# EAGLE design line_sensor (EAGLE 9.6.0)
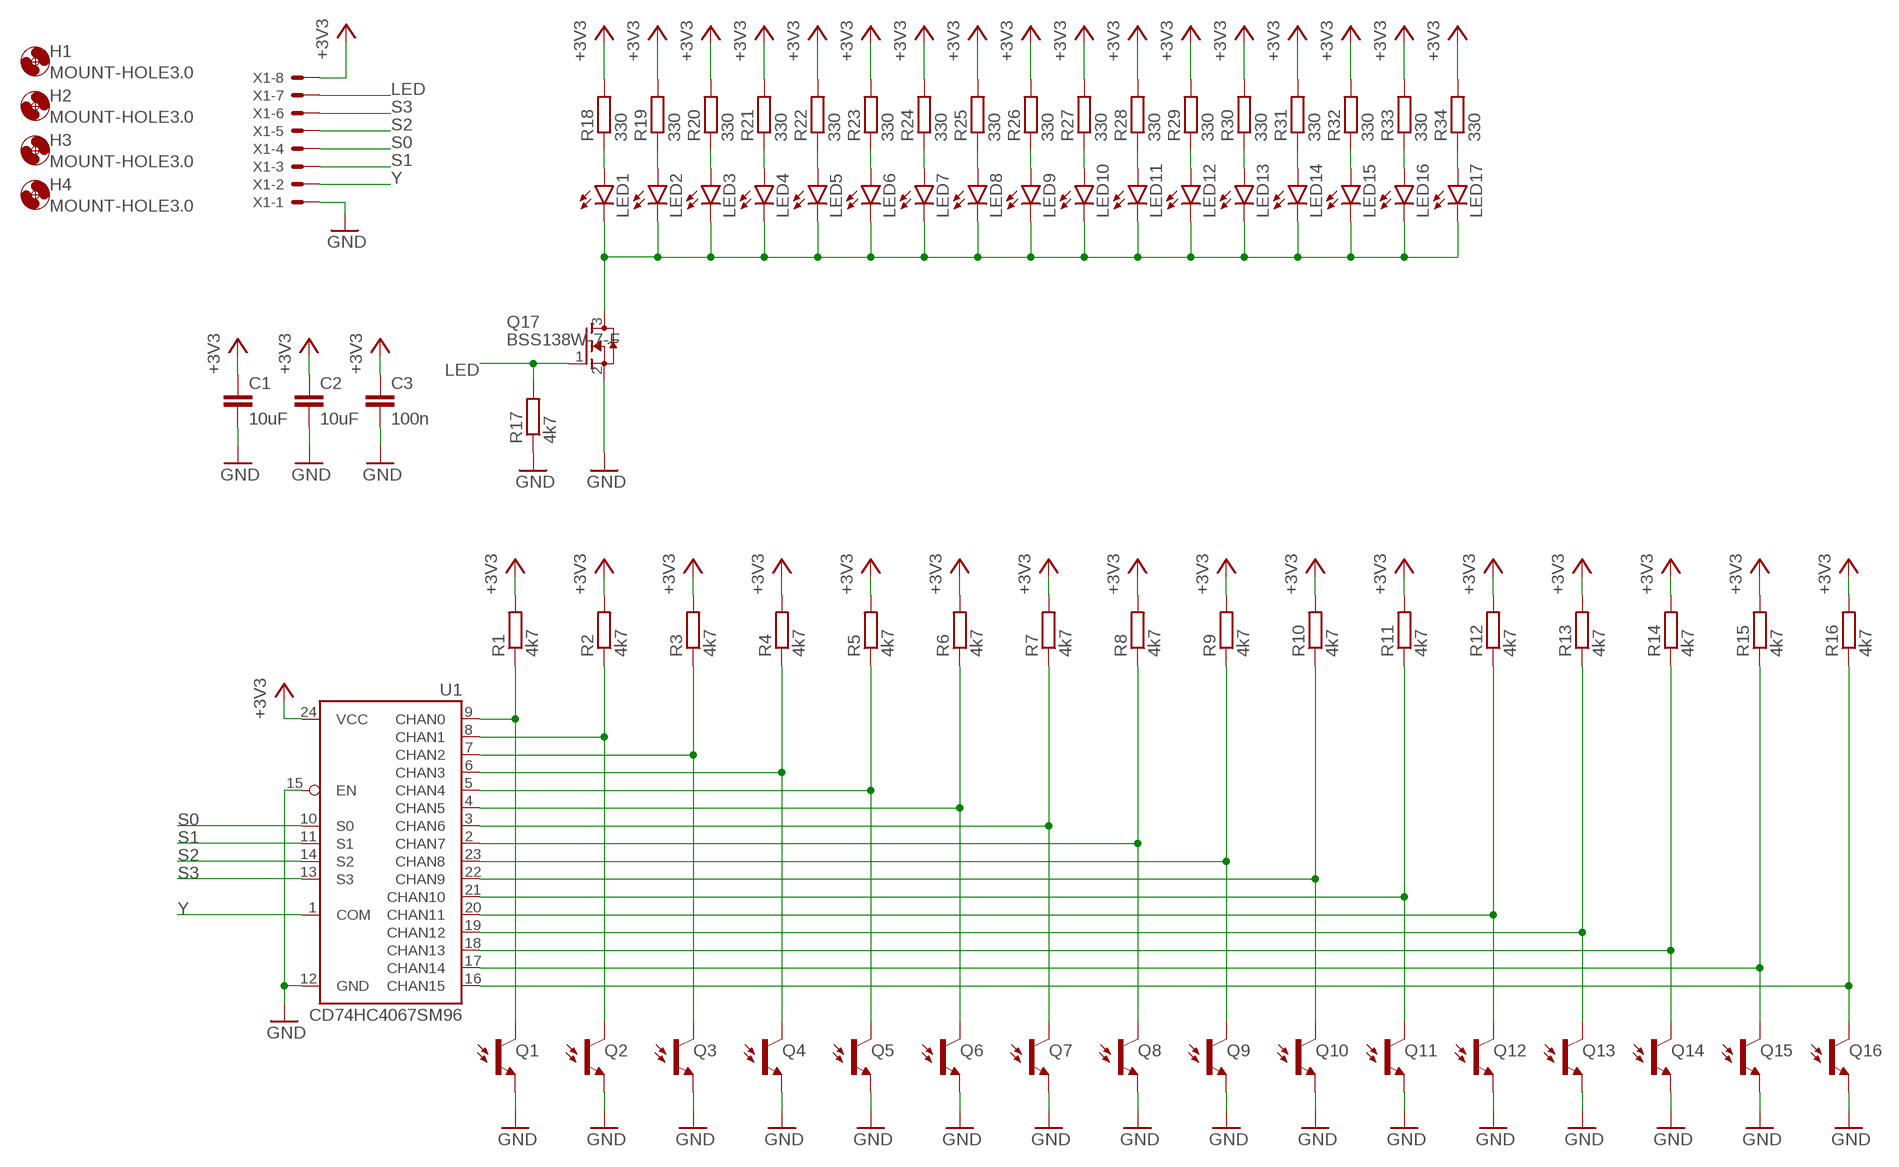
[diagram p0: schematic, sheet 1]

## Parts
C1  10uF  C-EUC0805  [C0805]
C2  10uF  C-EUC0805  [C0805]
C3  100n  C-EUC0805  [C0805]
H1  MOUNT-HOLE3.0  [3,0]
H2  MOUNT-HOLE3.0  [3,0]
H3  MOUNT-HOLE3.0  [3,0]
H4  MOUNT-HOLE3.0  [3,0]
LED1  LEDSML1206  [SML1206]
LED2  LEDSML1206  [SML1206]
LED3  LEDSML1206  [SML1206]
LED4  LEDSML1206  [SML1206]
LED5  LEDSML1206  [SML1206]
LED6  LEDSML1206  [SML1206]
LED7  LEDSML1206  [SML1206]
LED8  LEDSML1206  [SML1206]
LED9  LEDSML1206  [SML1206]
LED10  LEDSML1206  [SML1206]
LED11  LEDSML1206  [SML1206]
LED12  LEDSML1206  [SML1206]
LED13  LEDSML1206  [SML1206]
LED14  LEDSML1206  [SML1206]
LED15  LEDSML1206  [SML1206]
LED16  LEDSML1206  [SML1206]
LED17  LEDSML1206  [SML1206]
Q1  20mA/30V  PHOTOTRANSISTORPT17-21C-L41-TR8  [PT17-21C-L41-TR8]
Q2  20mA/30V  PHOTOTRANSISTORPT17-21C-L41-TR8  [PT17-21C-L41-TR8]
Q3  20mA/30V  PHOTOTRANSISTORPT17-21C-L41-TR8  [PT17-21C-L41-TR8]
Q4  20mA/30V  PHOTOTRANSISTORPT17-21C-L41-TR8  [PT17-21C-L41-TR8]
Q5  20mA/30V  PHOTOTRANSISTORPT17-21C-L41-TR8  [PT17-21C-L41-TR8]
Q6  20mA/30V  PHOTOTRANSISTORPT17-21C-L41-TR8  [PT17-21C-L41-TR8]
Q7  20mA/30V  PHOTOTRANSISTORPT17-21C-L41-TR8  [PT17-21C-L41-TR8]
Q8  20mA/30V  PHOTOTRANSISTORPT17-21C-L41-TR8  [PT17-21C-L41-TR8]
Q9  20mA/30V  PHOTOTRANSISTORPT17-21C-L41-TR8  [PT17-21C-L41-TR8]
Q10  20mA/30V  PHOTOTRANSISTORPT17-21C-L41-TR8  [PT17-21C-L41-TR8]
Q11  20mA/30V  PHOTOTRANSISTORPT17-21C-L41-TR8  [PT17-21C-L41-TR8]
Q12  20mA/30V  PHOTOTRANSISTORPT17-21C-L41-TR8  [PT17-21C-L41-TR8]
Q13  20mA/30V  PHOTOTRANSISTORPT17-21C-L41-TR8  [PT17-21C-L41-TR8]
Q14  20mA/30V  PHOTOTRANSISTORPT17-21C-L41-TR8  [PT17-21C-L41-TR8]
Q15  20mA/30V  PHOTOTRANSISTORPT17-21C-L41-TR8  [PT17-21C-L41-TR8]
Q16  20mA/30V  PHOTOTRANSISTORPT17-21C-L41-TR8  [PT17-21C-L41-TR8]
Q17  BSS138W-7-F  [SOT323]
R1  4k7  R-EU_M0805  [M0805]
R2  4k7  R-EU_M0805  [M0805]
R3  4k7  R-EU_M0805  [M0805]
R4  4k7  R-EU_M0805  [M0805]
R5  4k7  R-EU_M0805  [M0805]
R6  4k7  R-EU_M0805  [M0805]
R7  4k7  R-EU_M0805  [M0805]
R8  4k7  R-EU_M0805  [M0805]
R9  4k7  R-EU_M0805  [M0805]
R10  4k7  R-EU_M0805  [M0805]
R11  4k7  R-EU_M0805  [M0805]
R12  4k7  R-EU_M0805  [M0805]
R13  4k7  R-EU_M0805  [M0805]
R14  4k7  R-EU_M0805  [M0805]
R15  4k7  R-EU_M0805  [M0805]
R16  4k7  R-EU_M0805  [M0805]
R17  4k7  R-EU_M0805  [M0805]
R18  330  R-EU_M0805  [M0805]
R19  330  R-EU_M0805  [M0805]
R20  330  R-EU_M0805  [M0805]
R21  330  R-EU_M0805  [M0805]
R22  330  R-EU_M0805  [M0805]
R23  330  R-EU_M0805  [M0805]
R24  330  R-EU_M0805  [M0805]
R25  330  R-EU_M0805  [M0805]
R26  330  R-EU_M0805  [M0805]
R27  330  R-EU_M0805  [M0805]
R28  330  R-EU_M0805  [M0805]
R29  330  R-EU_M0805  [M0805]
R30  330  R-EU_M0805  [M0805]
R31  330  R-EU_M0805  [M0805]
R32  330  R-EU_M0805  [M0805]
R33  330  R-EU_M0805  [M0805]
R34  330  R-EU_M0805  [M0805]
U1  CD74HC4067SM96  74HC4067SM96  [SSOP24]
X1  52745-0890  [52745-0890]

## Nets
+3V3: C1.1 C2.1 C3.1 R1.2 R2.2 R3.2 R4.2 R5.2 R6.2 R7.2 R8.2 R9.2 R10.2 R11.2 R12.2 R13.2 R14.2 R15.2 R16.2 R18.2 R19.2 R20.2 R21.2 R22.2 R23.2 R24.2 R25.2 R26.2 R27.2 R28.2 R29.2 R30.2 R31.2 R32.2 R33.2 R34.2 U1.24(VCC) X1.8
GND: C1.2 C2.2 C3.2 Q1.E Q2.E Q3.E Q4.E Q5.E Q6.E Q7.E Q8.E Q9.E Q10.E Q11.E Q12.E Q13.E Q14.E Q15.E Q16.E Q17.2(S) R17.1 U1.12(GND) U1.15(EN) X1.1
LED: Q17.1(G) R17.2 X1.7
N$1: Q2.C R2.1 U1.8(CHAN1)
N$2: Q1.C R1.1 U1.9(CHAN0)
N$3: Q3.C R3.1 U1.7(CHAN2)
N$4: Q4.C R4.1 U1.6(CHAN3)
N$5: LED1.A R18.1
N$8: LED2.A R19.1
N$9: LED1.C LED2.C LED3.C LED4.C LED5.C LED6.C LED7.C LED8.C LED9.C LED10.C LED11.C LED12.C LED13.C LED14.C LED15.C LED16.C LED17.C Q17.3(D)
N$10: Q5.C R5.1 U1.5(CHAN4)
N$11: Q6.C R6.1 U1.4(CHAN5)
N$12: Q7.C R7.1 U1.3(CHAN6)
N$13: Q8.C R8.1 U1.2(CHAN7)
N$14: Q9.C R9.1 U1.23(CHAN8)
N$15: Q10.C R10.1 U1.22(CHAN9)
N$16: Q11.C R11.1 U1.21(CHAN10)
N$17: Q12.C R12.1 U1.20(CHAN11)
N$18: Q13.C R13.1 U1.19(CHAN12)
N$19: Q14.C R14.1 U1.18(CHAN13)
N$20: Q15.C R15.1 U1.17(CHAN14)
N$21: Q16.C R16.1 U1.16(CHAN15)
N$23: LED3.A R20.1
N$26: LED4.A R21.1
N$29: LED5.A R22.1
N$32: LED6.A R23.1
N$35: LED7.A R24.1
N$38: LED8.A R25.1
N$41: LED9.A R26.1
N$44: LED10.A R27.1
N$47: LED11.A R28.1
N$50: LED12.A R29.1
N$53: LED13.A R30.1
N$56: LED14.A R31.1
N$59: LED15.A R32.1
N$62: LED16.A R33.1
N$65: LED17.A R34.1
S0: U1.10(S0) X1.4
S1: U1.11(S1) X1.3
S2: U1.14(S2) X1.5
S3: U1.13(S3) X1.6
Y: U1.1(COM) X1.2

## Library data of the parts
C1-C3 = rcl:C-EU: CAPACITOR, European symbol; SPICEPREFIX: C
H1-H4 = holes:MOUNT-HOLE: MOUNTING HOLE with drill center marker
LED1-LED17 = led:LED: LED OSRAM: - CHIPLED LG R971, LG N971, LY N971, LG Q971, LY Q971, LO R971, LY R971 LH N974, LH R974 LS Q976, LO Q976, LY Q976 LO Q996 - Hyper CHIPLED LW Q18S LB Q993, LB Q99A, LB R99A - SideLED LS A670, LO A670, LY A670, LG A670, LP A670 LB A673, LV A673, LT A673, LW A673 LH A674 LY A675 LS A676, LA A676, LO A676, LY A676, LW A676 LS A679, LY A679, LG A679 - Hyper Micro SIDELED® LS Y876, LA Y876, LO Y876, LY Y876 LT Y87S - SmartLED LW L88C, LW L88S LB L89C, LB L89S, LG L890 LS L89K, LO L89K, LY L89K LS L896, LA L896, LO L896, LY L896 - TOPLED LS T670, LO T670, LY T670, LG T670, LP T670 LSG T670, LSP T670, LSY T670, LOP T670, LYG T670 LG T671, LOG T671, LSG T671 LB T673, LV T673, LT T673, LW T673 LH T674 LS T676, LA T676, LO T676, LY T676, LB T676, LH T676, LSB T676, LW T676 LB T67C, LV T67C, LT T67C, LS T67K, LO T67K, LY T67K, LW E67C LS E67B, LA E67B, LO E67B, LY E67B, LB E67C, LV E67C, LT E67C LW T67C LS T679, LY T679, LG T679 LS T770, LO T770, LY T770, LG T770, LP T770 LB T773, LV T773, LT T773, LW T773 LH T774 LS E675, LA E675, LY E675, LS T675 LS T776, LA T776, LO T776, LY T776, LB T776 LHGB T686 LT T68C, LB T68C - Hyper Mini TOPLED® LB M676 - Mini TOPLED Santana® LG M470 LS M47K, LO M47K, LY M47K Source: http://www.osram.convergy.de LUXEON: - LUMILED® LXK2-PW12-R00, LXK2-PW12-S00, LXK2-PW14-U00, LXK2-PW14-V00 LXK2-PM12-R00, LXK2-PM12-S00, LXK2-PM14-U00 LXK2-PE12-Q00, LXK2-PE12-R00, LXK2-PE12-S00, LXK2-PE14-T00, LXK2-PE14-U00 LXK2-PB12-K00, LXK2-PB12-L00, LXK2-PB12-M00, LXK2-PB14-N00, LXK2-PB14-P00, LXK2-PB14-Q00 LXK2-PR12-L00, LXK2-PR12-M00, LXK2-PR14-Q00, LXK2-PR14-R00 LXK2-PD12-Q00, LXK2-PD12-R00, LXK2-PD12-S00 LXK2-PH12-R00, LXK2-PH12-S00 LXK2-PL12-P00, LXK2-PL12-Q00, LXK2-PL12-R00 Source: www.luxeon.com KINGBRIGHT: KA-3528ASYC Source: www.kingbright.com
Q1-Q16 = SparkFun-DiscreteSemi:PHOTOTRANSISTOR: Phototransistor PT17-21C/L41/TR8 is a phototransistor in miniature SMD package which is molded in a water clear with flat top view lens. The device is Spectrally matched to visible and infrared emitting diode. Datasheet <http://www.everlight.com/file/ProductFile/PT17-21C-L41-TR8.pdf> SparkFun Products: SparkFun Electric Imp imp002 Breakout <https://www.sparkfun.com/products/12958>; PROD_ID: TRANS-12141
Q17 = borkedlabs-transistors:BSS138W-7-F: N-FET; MANU: DIODES INC; MPN: BSS138W-7-F; PACKAGE: SOT323
R1-R34 = rcl:R-EU_: RESISTOR, European symbol; SPICEPREFIX: R
U1 = SparkFun-IC-Logic:74*4067: 16-channel analog MUX Datasheet <http://www.sparkfun.com/datasheets/IC/cd74hc4067.pdf> SparkFun Products MP3 Trigger <https://www.sparkfun.com/products/13720> (WIG-13720) SparkFun Analog/Digital MUX Breakout - CD74HC4067 <https://www.sparkfun.com/products/9056> (BOB-09056); PROD_ID: IC-08252
X1 = con-molex:52745-0890: FFC/FPC-to-Board 0.50mm (.020") SMT Top Contact Right Angle, ZIF, Style Receptacle 52745 / 52435 Source: http://www.molex.com/product/ffc/52745.html; MF: MOLEX; MPN: 52745-0890; OC_FARNELL: unknown; OC_NEWARK: 92M6377

## Board
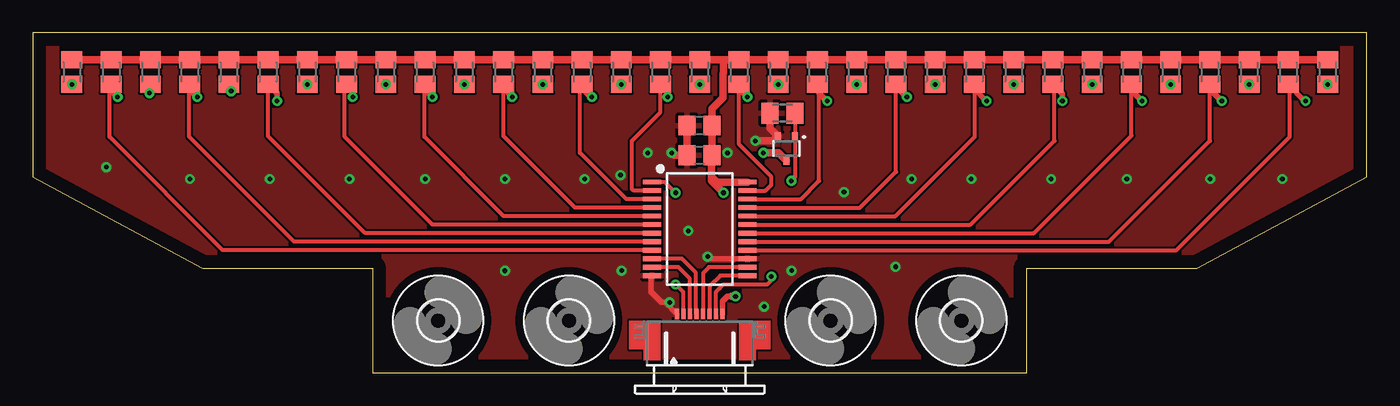
[diagram p1: board, top side]
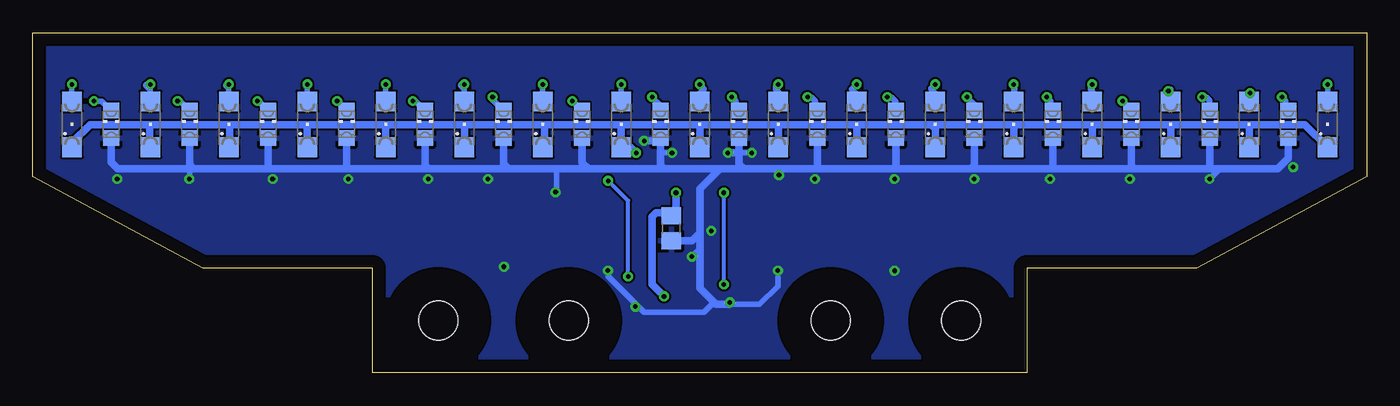
[diagram p2: board, bottom side, seen from below]

Size 102 x 26 mm. Coordinates in mm from the lower left corner, seen from the top.
Outline: 13,8 26,8 26,0 76,0 76,8 89,8 102,15 102,26 0,26 0,15 13,8
Copper layers (1*16): Top 0.035mm / dielectric 1.5mm / Bottom 0.035mm
Design rules "default": minimum track width 6mil, minimum drill 0.35mm, track to track 6mil, track to pad 6mil, pad to pad 6mil, via to via 6mil, smd to smd 6mil, copper to edge 40mil, drill to drill 6mil, minimum pad ring 10mil, minimum via ring 8mil, stop-mask expansion 4mil, vias tented up to drill 0mil, thermal gap 10mil

### Footprints (pad centres in the part's own frame; a part is rotated, then mirrored left to right if it is on the bottom)
C0805 = smd 1.3 x 1.5: 1 -0.95,0; 2 0.95,0
3,0 = hole 3: 0,0
SML1206 = smd 1.5 x 1.5: A 1.75,0; C -1.75,0
PT17-21C-L41-TR8 = smd 1.2 x 1.2: C 0,1.05; E 0,-1.05
SOT323 = smd 0.47 x 0.6: 1 -0.65,-0.95; 2 0.65,-0.95; 3 0,0.95
M0805 = smd 1.3 x 1.6: 1 -0.95,0; 2 0.95,0
SSOP24 = smd 0.348 x 1.397: 1 -3.575,-3.656; 2 -2.925,-3.656; 3 -2.275,-3.656; 4 -1.625,-3.656; 5 -0.975,-3.656; 6 -0.325,-3.656; 7 0.325,-3.656; 8 0.975,-3.656; 9 1.625,-3.656; 10 2.275,-3.656; 11 2.925,-3.656; 12 3.575,-3.656; 13 3.575,3.656; 14 2.925,3.656; 15 2.275,3.656; 16 1.625,3.656; 17 0.975,3.656; 18 0.325,3.656; 19 -0.325,3.656; 20 -0.975,3.656; 21 -1.625,3.656; 22 -2.275,3.656; 23 -2.925,3.656; 24 -3.575,3.656
52745-0890 = smd 0.3 x 0.8: 1 -1.75,2.5; 2 -1.25,2.5; 3 -0.75,2.5; 4 -0.25,2.5; 5 0.25,2.5; 6 0.75,2.5; 7 1.25,2.5; 8 1.75,2.5

### Placement (x,y rotation side)
C1  53.17,11.05 270 bottom
C2  50.97,18.9 180 top
C3  50.97,16.63 180 top
H1  61,4 0 top
H2  31,4 0 top
H3  71,4 0 top
H4  41,4 0 top
LED1  3,19 90 bottom
LED2  9,19 90 bottom
LED3  15,19 90 bottom
LED4  21,19 90 bottom
LED5  27,19 90 bottom
LED6  33,19 90 bottom
LED7  39,19 90 bottom
LED8  45,19 90 bottom
LED9  51,19 90 bottom
LED10  57,19 90 bottom
LED11  63,19 90 bottom
LED12  69,19 90 bottom
LED13  75,19 90 bottom
LED14  81,19 90 bottom
LED15  87,19 90 bottom
LED16  93,19 90 bottom
LED17  99,19 90 bottom
Q1  6,19 0 bottom
Q2  12,19 0 bottom
Q3  18,19 0 bottom
Q4  24,19 0 bottom
Q5  30,19 0 bottom
Q6  36,19 0 bottom
Q7  42,19 0 bottom
Q8  48,19 0 bottom
Q9  54,19 0 bottom
Q10  60,19 0 bottom
Q11  66,19 0 bottom
Q12  72,19 0 bottom
Q13  78,19 0 bottom
Q14  84,19 0 bottom
Q15  90,19 0 bottom
Q16  96,19 0 bottom
Q17  57.62,17.15 180 top
R1  6,23 90 top
R2  12,23 90 top
R3  18,23 90 top
R4  24,23 90 top
R5  30,23 90 top
R6  36,23 90 top
R7  42,23 90 top
R8  48,23 90 top
R9  54,23 90 top
R10  60,23 90 top
R11  66,23 90 top
R12  72,23 90 top
R13  78,23 90 top
R14  84,23 90 top
R15  90,23 90 top
R16  96,23 90 top
R17  57.32,19.84 0 top
R18  3,23 90 top
R19  9,23 90 top
R20  15,23 90 top
R21  21,23 90 top
R22  27,23 90 top
R23  33,23 90 top
R24  39,23 90 top
R25  45,23 90 top
R26  51,23 90 top
R27  57,23 90 top
R28  63,23 90 top
R29  69,23 90 top
R30  75,23 90 top
R31  81,23 90 top
R32  87,23 90 top
R33  93,23 90 top
R34  99,23 90 top
U1  51,11 270 top
X1  51,2 0 top

### Tracks (layer width: path | path; a pad name or v marks a point on that pad's centre or on a via)
+3V3  (via drill 0.35)
  Top 0.406: X1.8 52.75,5.47 53.12,5.84 53.43,5.84
  Top 0.559: R18.2 R1.2 R19.2 R2.2 R20.2 R3.2 R21.2 R4.2 R22.2 R5.2 R23.2 R6.2 R24.2 R7.2 R25.2 R8.2 R26.2 52.82,23.95 | 52.82,23.95 R9.2 R27.2 R10.2 R28.2 R11.2 R29.2 | R12.2 R29.2 | R29.2 R30.2 R13.2 R31.2 R14.2 R32.2 R15.2 R33.2 R16.2 R34.2 | 52.82,23.95 52.82,22.93 52.77,22.88 52.77,21.03 51.92,20.19 C2.1 51.92,17.12 | C3.1 51.92,17.12 | U1.24 52.31,14.58 51.9,14.99 | 51.9,14.99 51.9,17.1 51.92,17.12 | v52.82,13.77 51.9,14.68 51.9,14.99 | 53.43,5.84 v53.73,5.84
  Bottom 0.559: v52.82,13.77 52.82,12.36 C1.1 53.42,12.24 54.34,12.24 54.65,11.94 54.65,6.76 v53.73,5.84
GND  (via drill 0.35)
  Top 0.406: U1.15 51.76,8.73 v51.6,8.89 | U1.12 47.27,7.35 47.27,6.21 48.09,5.39 | 48.09,5.39 v48.7,5.39 | X1.1 48.36,5.39 48.09,5.39
  Top 0.559: C2.2 C3.2 49.04,16.63 v48.85,16.82 | R17.1 56.37,18.7 Q17.2 56.61,17.73 v55.25,17.73
  Bottom 0.406: v51.6,8.89 50.99,9.5 | 10.75,15.6 11.24,15.6 v12.03,14.82 | v47.02,16.82 48,16.82 | v53.12,16.82 54,16.82 | v62.02,13.82 61.96,13.88 61.96,15.6 | v90.03,14.82 90,14.84 90,15.6 | v58.02,7.82 58.02,7.39 55.25,4.62 50.68,4.62 49.92,5.39 | v45.02,7.82 45.02,6.62 46.41,5.23 49.16,5.23
  Bottom 0.559: Q1.E 6,16.39 6.79,15.6 10.75,15.6 11.97,15.6 | 11.97,15.6 17.76,15.6 | 17.76,15.6 23.86,15.6 | 23.86,15.6 30.26,15.6 | 30.26,15.6 36.05,15.6 | 36.05,15.6 41.84,15.6 | 41.84,15.6 47.63,15.6 | 47.63,15.6 49.46,15.6 | 49.46,15.6 53.73,15.6 | 53.73,15.6 59.52,15.6 | 59.52,15.6 61.96,15.6 65.62,15.6 | 65.62,15.6 71.71,15.6 | 71.71,15.6 77.81,15.6 | 77.81,15.6 83.91,15.6 | 83.91,15.6 89.7,15.6 | 89.7,15.6 90,15.6 95.49,15.6 96,16.11 Q16.E | Q15.E 90,15.9 89.7,15.6 | Q14.E 84,15.69 83.91,15.6 | Q13.E 78,15.79 77.81,15.6 | Q12.E 72,15.88 71.71,15.6 | Q11.E 66,15.98 65.62,15.6 | Q10.E 60,16.08 59.52,15.6 | 53.73,15.6 54,15.87 54,16.82 Q9.E 54.22,17.73 v55.25,17.73 | Q8.E 48,16.82 | 48,16.82 48,15.96 47.63,15.6 | Q7.E 42,15.75 41.84,15.6 | Q6.E 36,15.65 36.05,15.6 | Q5.E 30,15.86 30.26,15.6 | Q4.E 24,15.74 23.86,15.6 | Q3.E 18,15.83 17.76,15.6 | Q2.E 12,15.62 11.97,15.6 | v48.85,16.82 48,16.82 | 49.46,15.6 50.99,14.07 50.99,11.33 50.99,10.72 | 50.99,10.72 50.99,9.5 | 50.99,9.2 50.99,9.5 | C1.2 51.61,10.1 50.99,10.72 | 50.99,9.5 50.99,6.45 49.92,5.39 49.77,5.23 49.16,5.23 48.7,5.23 v48.7,5.39
  other vias: 18.12,14.82 24.22,14.82 5.62,15.73 30.01,14.82 36.1,14.82 42.2,14.82 50.12,10.85 67.19,14.82 71.77,14.82 77.86,14.82 83.65,14.82 95.54,14.82 36.1,7.81 55.92,5.06 65.97,8.11 44.94,15.12
  pour Top: -6.62,35.1 102.19,35.1 102.19,-8.79 -6.62,-8.79
  pour Bottom: 129.32,32.97 -9.97,32.97 -9.97,-11.84 129.32,-11.84
LED  (via drill 0.35)
  Top 0.305: R17.2 Q17.1 58.27,14.96 v58,14.68 | X1.7 52.25,6.19 52.51,6.45 52.82,6.76 56.17,6.76 56.47,7.06 v56.47,7.37
  Bottom 0.305: v56.47,7.37 56.47,13.16 v58,14.68
N$1  (via drill 0.35)
  Top 0.305: U1.8 19.98,10.02 11.97,18.03 11.97,22 11.97,22.02 R2.1
  Top 0.406: v12.58,21.08 11.97,21.69 11.97,22
  Bottom 0.406: Q2.C 12,20.81 12.28,21.08 v12.58,21.08
N$2  (via drill 0.35)
  Top 0.305: U1.9 14.54,9.38 5.88,18.03 5.88,21.93 R1.1
  Top 0.406: v6.49,21.08 5.88,21.69 5.88,21.93
  Bottom 0.406: Q1.C 6.18,20.23 6.18,20.78 v6.49,21.08
N$3  (via drill 0.35)
  Top 0.305: U1.7 25.43,10.67 18,18.1 R3.1
  Top 0.406: v18.68,20.78 18.68,21.37 R3.1
  Bottom 0.406: Q3.C 18,20.1 v18.68,20.78
N$4  (via drill 0.35)
  Top 0.305: U1.6 30.57,11.33 23.86,18.03 23.86,21.91 R4.1
  Top 0.406: v24.47,21.08 24.47,21.58 R4.1
  Bottom 0.406: Q4.C 24.16,20.22 24.16,20.78 v24.47,21.08
N$5  (via drill 0.35)
  Top 0.406: R18.1 2.78,22.05 2.52,22.3 2.75,22.3 R18.1
  Bottom 0.406: LED1.A R18.1
  other vias: 3,22.05
N$8  (via drill 0.35)
  Top 0.406: v8.93,21.39 8.93,21.98 R19.1
  Bottom 0.406: LED2.A 9,21.31 v8.93,21.39
N$9  (via drill 0.35)
  Top 0.559: Q17.3 57,16.82 v55.86,16.82
  Bottom 0.559: LED1.C 4.73,18.98 6.78,18.98 6.81,18.95 8.93,18.95 | 15.02,18.98 11.22,18.98 11.19,18.95 8.93,18.95 | 15.02,18.98 20.81,18.98 | 20.81,18.98 26.91,18.98 | 26.91,18.98 33.31,18.98 | 33.31,18.98 38.8,18.98 | 38.8,18.98 44.89,18.98 | 44.89,18.98 51.29,18.98 52.52,18.98 | 52.52,18.98 51,18.98 LED9.C | 52.52,18.98 57.08,18.98 | 57.08,18.98 62.87,18.98 | 62.87,18.98 68.97,18.98 | 68.97,18.98 74.76,18.98 | 74.76,18.98 80.86,18.98 | 80.86,18.98 86.95,18.98 | 86.95,18.98 93.05,18.98 | 93.05,18.98 97.59,18.98 99,17.57 LED17.C | LED16.C 93.05,17.3 93.05,18.98 | LED15.C 86.95,17.3 86.95,18.98 | LED14.C 81,18.84 80.86,18.98 | LED13.C 75,18.74 74.76,18.98 | LED12.C 68.97,17.28 68.97,18.98 | LED11.C 62.87,17.38 62.87,18.98 | 57.08,18.98 57,18.9 LED10.C 56.3,17.25 v55.86,16.82 | LED8.C 45,18.87 44.89,18.98 | LED7.C 39,18.78 38.8,18.98 | LED6.C 33,18.67 33.31,18.98 | LED5.C 27,18.89 26.91,18.98 | LED4.C 21,18.79 20.81,18.98 | LED3.C 15,18.96 15.02,18.98 | LED2.C 9,18.87 8.93,18.95
N$10  (via drill 0.35)
  Top 0.305: U1.5 36.02,11.98 29.96,18.03 29.96,22.01 R5.1
  Top 0.406: v30.57,21.08 29.96,21.69 29.96,22.01
  Bottom 0.406: Q5.C 30,20.52 v30.57,21.08
N$11  (via drill 0.35)
  Top 0.305: U1.4 41.46,12.62 36,18.09 R6.1
  Top 0.406: v36.66,21.08 36,21.74 R6.1
  Bottom 0.406: Q6.C 36,20.73 36.36,21.08 v36.66,21.08
N$12  (via drill 0.35)
  Top 0.305: U1.3 45.38,13.27 41.84,16.82 41.84,21.89 R7.1
  Top 0.406: v42.76,21.08 42.65,21.08 41.84,21.89
  Bottom 0.406: Q7.C 42.15,20.2 42.15,20.78 42.45,21.08 v42.76,21.08
N$13  (via drill 0.35)
  Top 0.305: U1.2 45.95,13.92 45.81,14.07 45.81,17.73 48,19.92 R8.1
  Top 0.406: v48.55,21.08 48.55,21.5 R8.1
  Bottom 0.406: Q8.C 48.24,20.29 48.24,20.78 v48.55,21.08
N$14  (via drill 0.35)
  Top 0.305: U1.23 56.02,13.92 56.47,14.38 56.47,14.99 54,17.46 R9.1
  Top 0.406: v54.65,21.08 54,21.73 R9.1
  Bottom 0.406: Q9.C 54,20.44 v54.65,21.08
N$15  (via drill 0.35)
  Top 0.305: U1.22 58.72,13.27 60.13,14.68 60.13,21.92 R10.1
  Top 0.406: v60.74,20.78 60.13,21.39 60.13,21.92
  Bottom 0.406: Q10.C 60.73,20.78 v60.74,20.78
N$16  (via drill 0.35)
  Top 0.305: U1.21 63.26,12.62 66,15.37 66,22 R11.1
  Top 0.406: v66.84,21.08 66,21.92 66,22
  Bottom 0.406: Q11.C 66.84,20.89 v66.84,21.08
N$17  (via drill 0.35)
  Top 0.305: U1.20 65.96,11.98 72.02,18.03 72.02,22.03 R12.1
  Top 0.406: v72.93,20.78 72.02,21.69 72.02,22.03
  Bottom 0.406: Q12.C 72.73,20.78 v72.93,20.78
N$18  (via drill 0.35)
  Top 0.305: U1.19 71.71,11.33 78.11,17.73 78.11,21.94 R13.1
  Top 0.406: v78.72,20.78 78.72,21.33 78.11,21.94
  Bottom 0.406: Q13.C v78.72,20.77 v78.72,20.78
N$19  (via drill 0.35)
  Top 0.305: U1.18 76.55,10.67 84,18.13 R14.1
  Top 0.406: v84.82,20.78 84,21.6 R14.1
  Bottom 0.406: Q14.C 84.73,20.78 v84.82,20.78
N$20  (via drill 0.35)
  Top 0.305: U1.17 82.3,10.02 90,17.73 90,22 R15.1
  Top 0.406: v90.92,20.78 90,21.69 90,22
  Bottom 0.406: Q15.C 90.73,20.78 v90.92,20.78
N$21  (via drill 0.35)
  Top 0.305: U1.16 87.44,9.38 96.1,18.03 96.1,21.95 R16.1
  Top 0.406: v97.32,20.78 97.27,20.78 R16.1
  Bottom 0.406: Q16.C 96.73,20.78 v97.32,20.78
N$23  (via drill 0.35)
  Top 0.406: v15.17,21.54 15,21.71 R20.1
  Bottom 0.406: LED3.A 15,21.67 15.02,21.69 v15.17,21.54
N$26  (via drill 0.35)
  Bottom 0.406: LED4.A 21,21.58 21.12,21.69 21.12,21.93 R21.1
  other vias: 21,22.05
N$29  (via drill 0.35)
  Top 0.406: R22.1 26.64,21.69 26.6,21.69 26.96,22.05 R22.1
  Bottom 0.406: LED5.A 27,21.6 26.91,21.69 26.91,21.96 R22.1
  other vias: 27,22.05
N$32  (via drill 0.35)
  Bottom 0.406: LED6.A 33,21.38 33.31,21.69 33.31,21.74 R23.1
  other vias: 33,22.05
N$35  (via drill 0.35)
  Bottom 0.406: LED7.A 39,21.29 39.41,21.69 39.05,22.05 R24.1
  other vias: 39,22.05
N$38  (via drill 0.35)
  Bottom 0.406: LED8.A 45,21.5 45.2,21.69 45.2,21.85 R25.1
  other vias: 45,22.05
N$41  (via drill 0.35)
  Bottom 0.406: LED9.A 51,21.38 50.68,21.69 50.68,21.73 R26.1
  other vias: 51,22.05
N$44  (via drill 0.35)
  Bottom 0.406: LED10.A 57,21.91 57.08,22 57.03,22.05 R27.1
  other vias: 57,22.05
N$47  (via drill 0.35)
  Bottom 0.406: LED11.A 63,21.82 63.18,22 63.13,22.05 R28.1
  other vias: 63,22.05
N$50  (via drill 0.35)
  Bottom 0.406: LED12.A 69,21.72 69.28,22 69.22,22.05 R29.1
  other vias: 69,22.05
N$53  (via drill 0.35)
  Bottom 0.406: LED13.A 75,21.93 75.07,22 75.01,22.05 R30.1
  other vias: 75,22.05
N$56  (via drill 0.35)
  Bottom 0.406: LED14.A 81,21.84 81.16,22 81.11,22.05 R31.1
  other vias: 81,22.05
N$59  (via drill 0.35)
  Bottom 0.406: LED15.A 87,21.74 87.26,22 87.21,22.05 R32.1
  other vias: 87,22.05
N$62  (via drill 0.35)
  Bottom 0.406: LED16.A 93,21.64 93.35,22 93.3,22.05 R33.1
  other vias: 93,22.05
N$65  (via drill 0.35)
  Bottom 0.406: LED17.A 99,21.85 99.15,22 99.09,22.05 R34.1
  other vias: 99,22.05
S0
  Top 0.305: U1.10 49.63,8.73 50.71,7.65 50.71,4.54 X1.4
S1
  Top 0.305: X1.3 50.25,7.19 49.37,8.08 U1.11
S2
  Top 0.305: X1.5 51.25,7.63 51.7,8.08 U1.14
S3
  Top 0.305: X1.6 51.75,6.61 52.57,7.42 U1.13
Y  (via drill 0.35)
  Top 0.305: X1.2 49.75,6.17 v49.16,6.76 | v49.16,13.77 48.35,14.58 U1.1
  Bottom 0.305: v49.16,6.76 v49.16,13.77